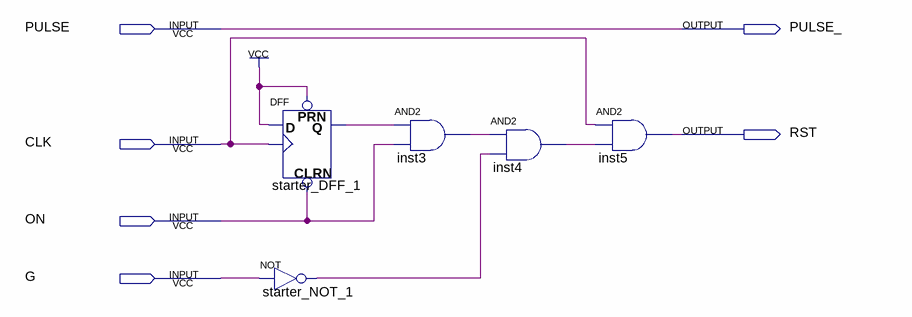
[diagram p0: schematic sheet]
// Quartus schematic starter.bdf as structural Verilog: 5 symbols, 6 pins
module starter (
  input  PULSE,
  input  CLK,
  input  ON,
  input  G,
  output PULSE_,
  output RST
);

  wire inst3_out, inst4_out, starter_DFF_1_q, starter_NOT_1_out;

  DFF starter_DFF_1 (.CLRN(ON), .CLK(CLK), .D(1'b1), .PRN(1'b1), .Q(starter_DFF_1_q));
  not starter_NOT_1 (starter_NOT_1_out, G);
  and inst3 (inst3_out, starter_DFF_1_q, ON);
  and inst4 (inst4_out, inst3_out, starter_NOT_1_out);
  and inst5 (RST, CLK, inst4_out);

  assign PULSE_ = PULSE;
endmodule
